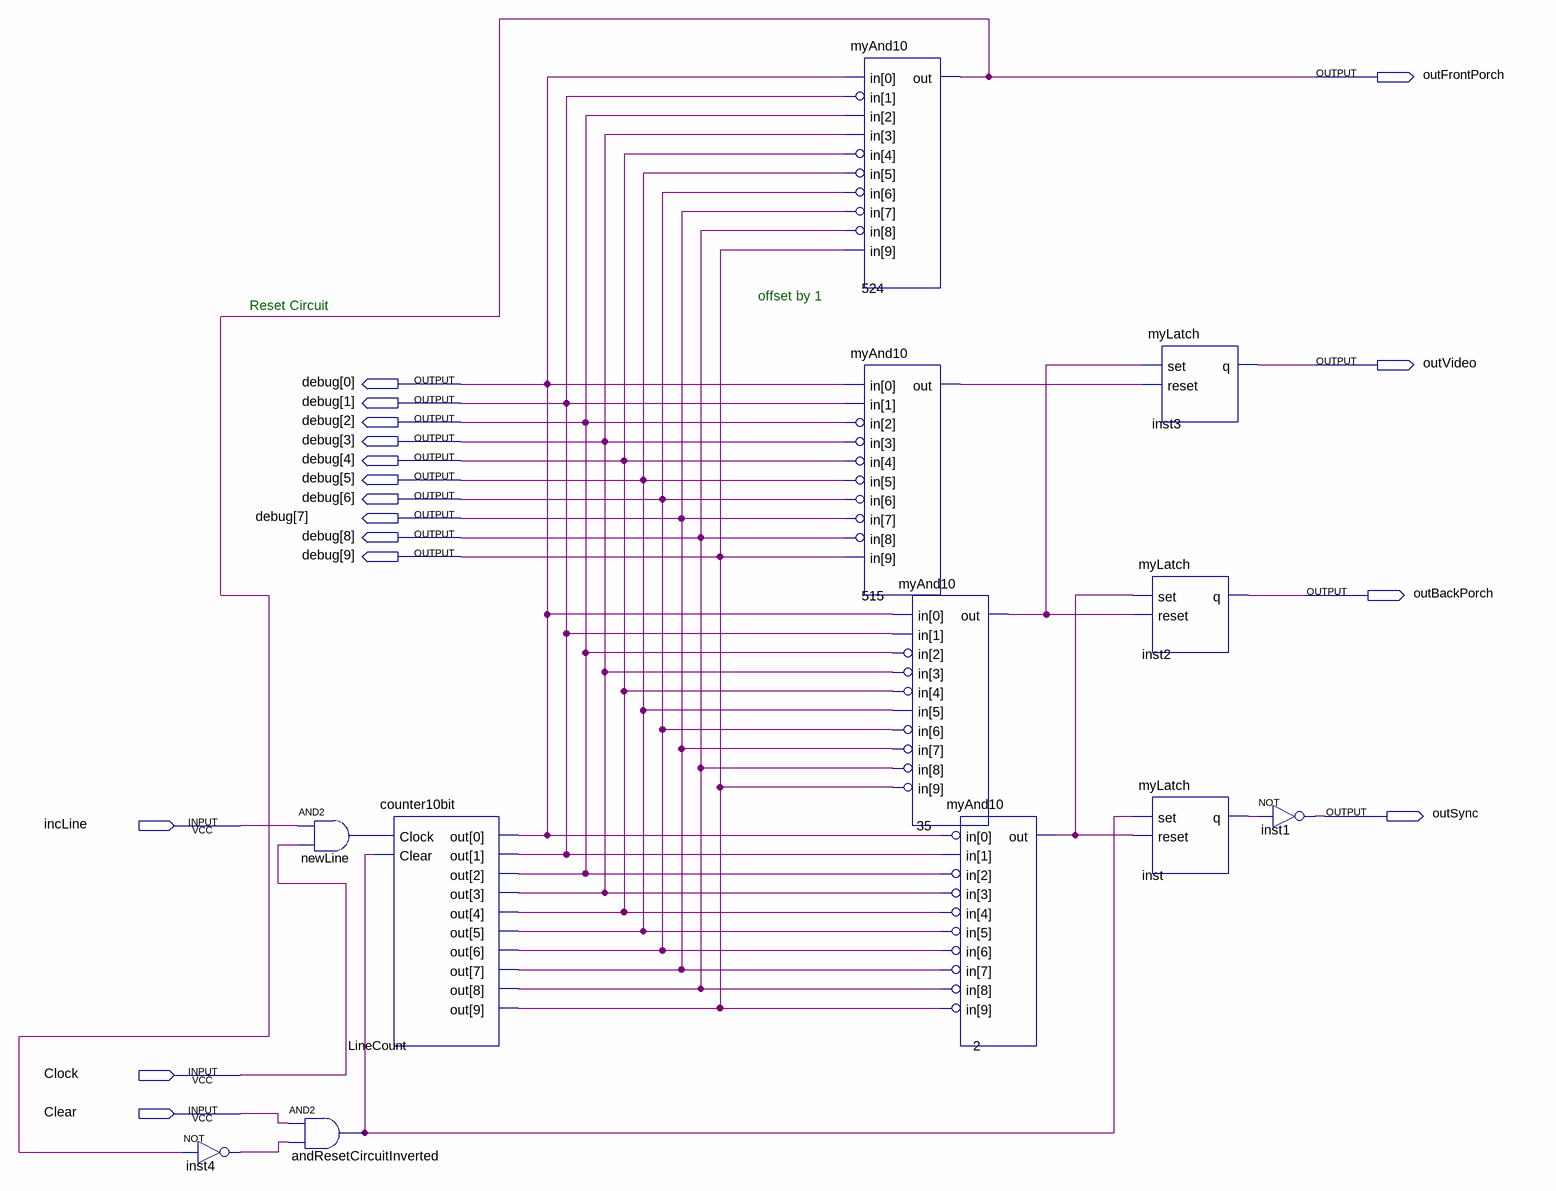
[diagram p0: schematic sheet]
// Quartus schematic counterVerticalSync.bdf as structural Verilog: 12 symbols, 17 pins
module counterVerticalSync (
  input  incLine,
  input  Clock,
  input  Clear,
  output outFrontPorch,
  output outVideo,
  output [9:0] debug,
  output outBackPorch,
  output outSync
);

  wire andResetCircuitInverted_out, inst4_out, inst_q, n2_out, n35_out, n515_out, newLine_out;

  not inst4 (inst4_out, outFrontPorch);
  and newLine (newLine_out, incLine, Clock);
  and andResetCircuitInverted (andResetCircuitInverted_out, Clear, inst4_out);
  counter10bit LineCount (.Clock(newLine_out), .Clear(andResetCircuitInverted_out), .out(debug));
  myAnd10 u_524 (.in(debug), .out(outFrontPorch));
  myAnd10 u_515 (.in(debug), .out(n515_out));
  myAnd10 u_35 (.in(debug), .out(n35_out));
  myAnd10 u_2 (.in(debug), .out(n2_out));
  myLatch inst3 (.set(n35_out), .reset(n515_out), .q(outVideo));
  myLatch inst2 (.set(n2_out), .reset(n35_out), .q(outBackPorch));
  myLatch inst (.set(andResetCircuitInverted_out), .reset(n2_out), .q(inst_q));
  not inst1 (outSync, inst_q);

  // Notes on the sheet:
  //   offset by 1
  //   Reset Circuit
endmodule
